# EAGLE design remote (EAGLE 7.6.0)
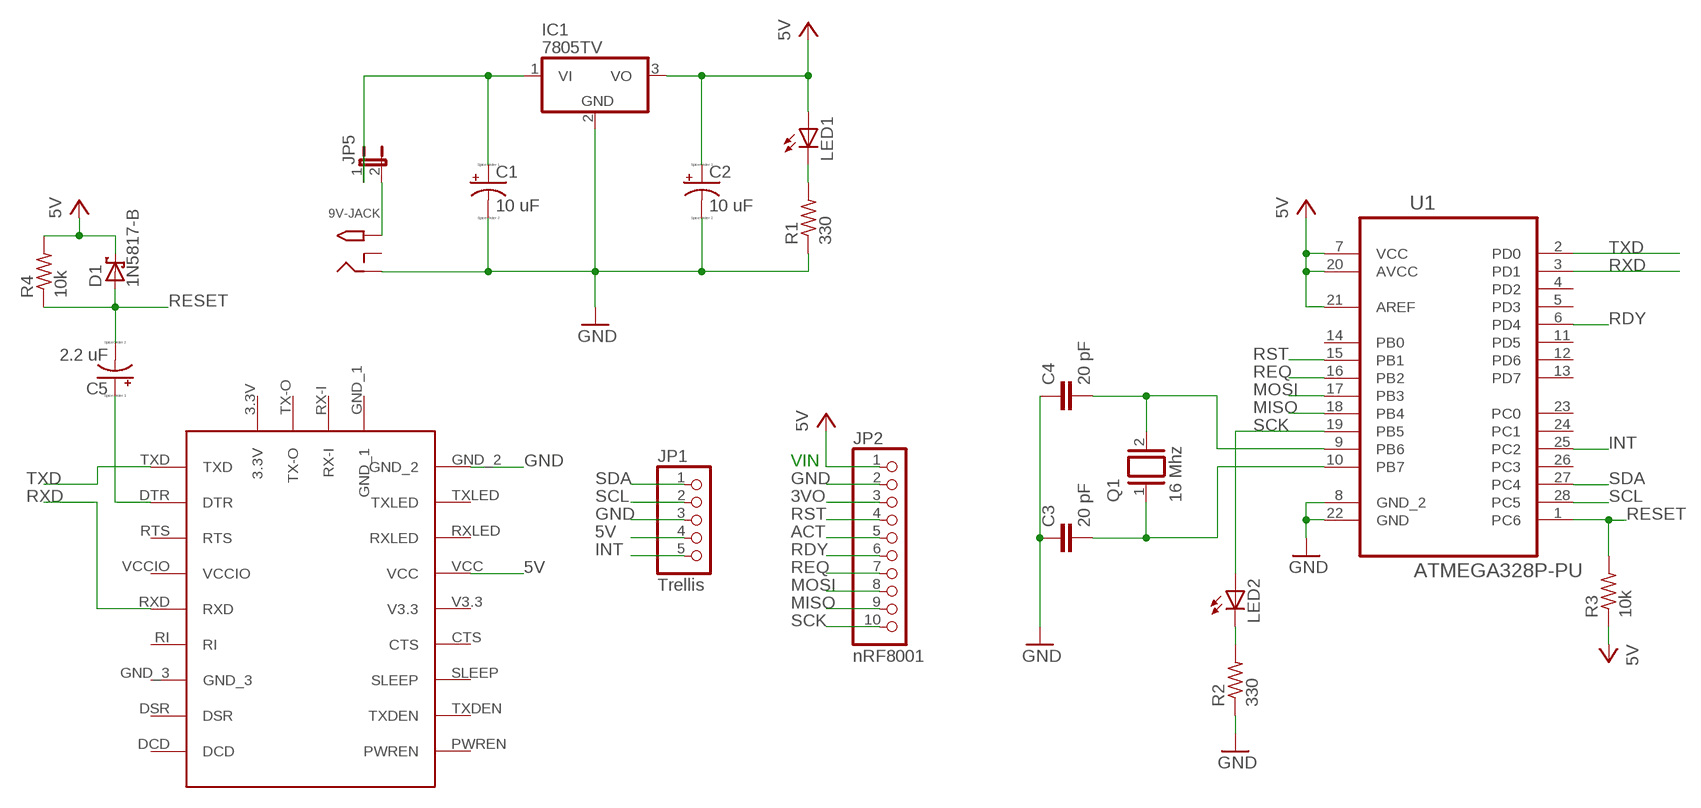
[diagram p0: schematic, sheet 1]

## Parts
9V-JACK  9V Input  2.1MMJACKTHM  [PJ-102A]
C1  10 uF  CPOL-USB45181B  [B45181B]
C2  10 uF  CPOL-USB45181B  [B45181B]
C3  20 pF  C-EU050-025X075  [C050-025X075]
C4  20 pF  C-EU050-025X075  [C050-025X075]
C5  2.2 uF  CPOL-USB45181B  [B45181B]
D1  1N5817-B  [DO41-7.6]
IC1  7805TV  [TO220V]
JP1  Trellis  PINHD-1X5  [1X05]
JP2  nRF8001  PINHD-1X10  [1X10]
JP5  JP1E  [JP1]
LED1  LED3MM  [LED3MM]
LED2  LED3MM  [LED3MM]
Q1  16 Mhz  XTAL/S  [QS]
R1  330  RESISTOR0309/10  [RES400MIL]
R2  330  RESISTOR0309/10  [RES400MIL]
R3  10k  RESISTOR0309/10  [RES400MIL]
R4  10k  RESISTOR0309/10  [RES400MIL]
U1  ATMEGA328P-PU  [DIP254P762X457-28]
U$1  FT232  [FT232]

## Nets
3VO: JP2.3
5V [power]: C2.+ D1.C IC1.3(VO) JP1.4 JP2.1 LED1.A R3.1 R4.2 U1.7(VCC) U1.20(AVCC) U1.21(AREF) U$1.VCC
ACT: JP2.5
GND [power]: 9V-JACK.RING C1.- C2.- C3.1 C4.1 IC1.2(GND) JP1.3 JP2.2 R1.1 R2.1 U1.8(GND_2) U1.22(GND) U$1.GND_2
INT: JP1.5 U1.25(PC2)
MISO: JP2.9 U1.18(PB4)
MOSI: JP2.8 U1.17(PB3)
N$1 [power]: C1.+ IC1.1(VI) JP5.1
N$2: LED1.K(C) R1.2
N$4: C3.2 Q1.1 U1.10(PB7)
N$5: C4.2 Q1.2 U1.9(PB6)
N$7: C5.+ U$1.DTR
N$8 [power]: 9V-JACK.TIP JP5.2
N$9: LED2.K(C) R2.2
RDY: JP2.6 U1.6(PD4)
REQ: JP2.7 U1.16(PB2)
RESET: C5.- D1.A R3.2 R4.1 U1.1(PC6)
RST: JP2.4 U1.15(PB1)
RXD: U1.3(PD1) U$1.RXD
SCK: JP2.10 LED2.A U1.19(PB5)
SCL: JP1.2 U1.28(PC5)
SDA: JP1.1 U1.27(PC4)
TXD: U1.2(PD0) U$1.TXD
Unconnected: 9V-JACK.RING_SW U1.4(PD2) U1.5(PD3) U1.11(PD5) U1.12(PD6) U1.13(PD7) U1.14(PB0) U1.23(PC0) U1.24(PC1) U1.26(PC3) U$1.3.3V U$1.CTS U$1.DCD U$1.DSR U$1.GND_1 U$1.GND_3 U$1.PWREN U$1.RI U$1.RTS U$1.RX-I U$1.RXLED U$1.SLEEP U$1.TX-O U$1.TXDEN U$1.TXLED U$1.V3.3 U$1.VCCIO

## Notes on the sheet
- VIN

## Library data of the parts
9V-JACK = adafruit:2.1MMJACK: 2.1mm x 5.5mm THM DC jack with internal switch. Digikey part #PJ-102A, 4UCON part #05537 2.1mm x 5.5mm SMT DC jack with internal switch. Digikey part #PJ-002A-SMT, 4UCON part #03267 By microbuilder.eu & adafruit.com
C1 C2 C5 = resistor:CPOL-US: POLARIZED CAPACITOR, American symbol
C3 C4 = resistor:C-EU: CAPACITOR, European symbol
D1 = diode:1N581*: 1.0A SCHOTTKY BARRIER RECTIFIER Source: http://www.diodes.com/datasheets/ds23001.pdf
IC1 = linear:78*: Positive VOLTAGE REGULATOR Source: http://cache.national.com/ds/LM/LM78L05.pdf http://www.fairchildsemi.com/ds/LM/LM7805.pdf
JP1 = pinhead:PINHD-1X5: PIN HEADER
JP2 = pinhead:PINHD-1X10: PIN HEADER
JP5 = jumper:JP1E: JUMPER
LED1 LED2 = EE445L:LED: Avago Technologies LED Green 2mA 5mm diffused, HLMP-4740, Digikey 516-1327-ND Red 1.6V 1mA 5mm diffused, HLMP-D150, Digikey 516-1323-ND Yellow 2mA 5mm diffused, HLMP-4719, Digikey 516-1326-ND Orange 10mA 5mm diffused HLMP-D401, Digikey 516-1330-ND Blue 10mA 5mm diffused
Q1 = special:XTAL/S: CRYSTAL
R1-R4 = EE445L:RESISTOR: RESISTOR, American symbol
U1 = Atmel_By_element14_Batch_1-00:ATMEGA328P-PU: 8-bit Microcontroller with In-System Programmable Flash; MPN: ATMEGA328P-PU; OC_FARNELL: 1715487; OC_NEWARK: 15R0268; PACKAGE: PDIP-28; SUPPLIER: Atmel
U$1 = ft232:FT232

## Net classes
0 default: width 0.406 mm, clearance 0.254 mm
1 power: width 0.711 mm, clearance 0.254 mm

## Board
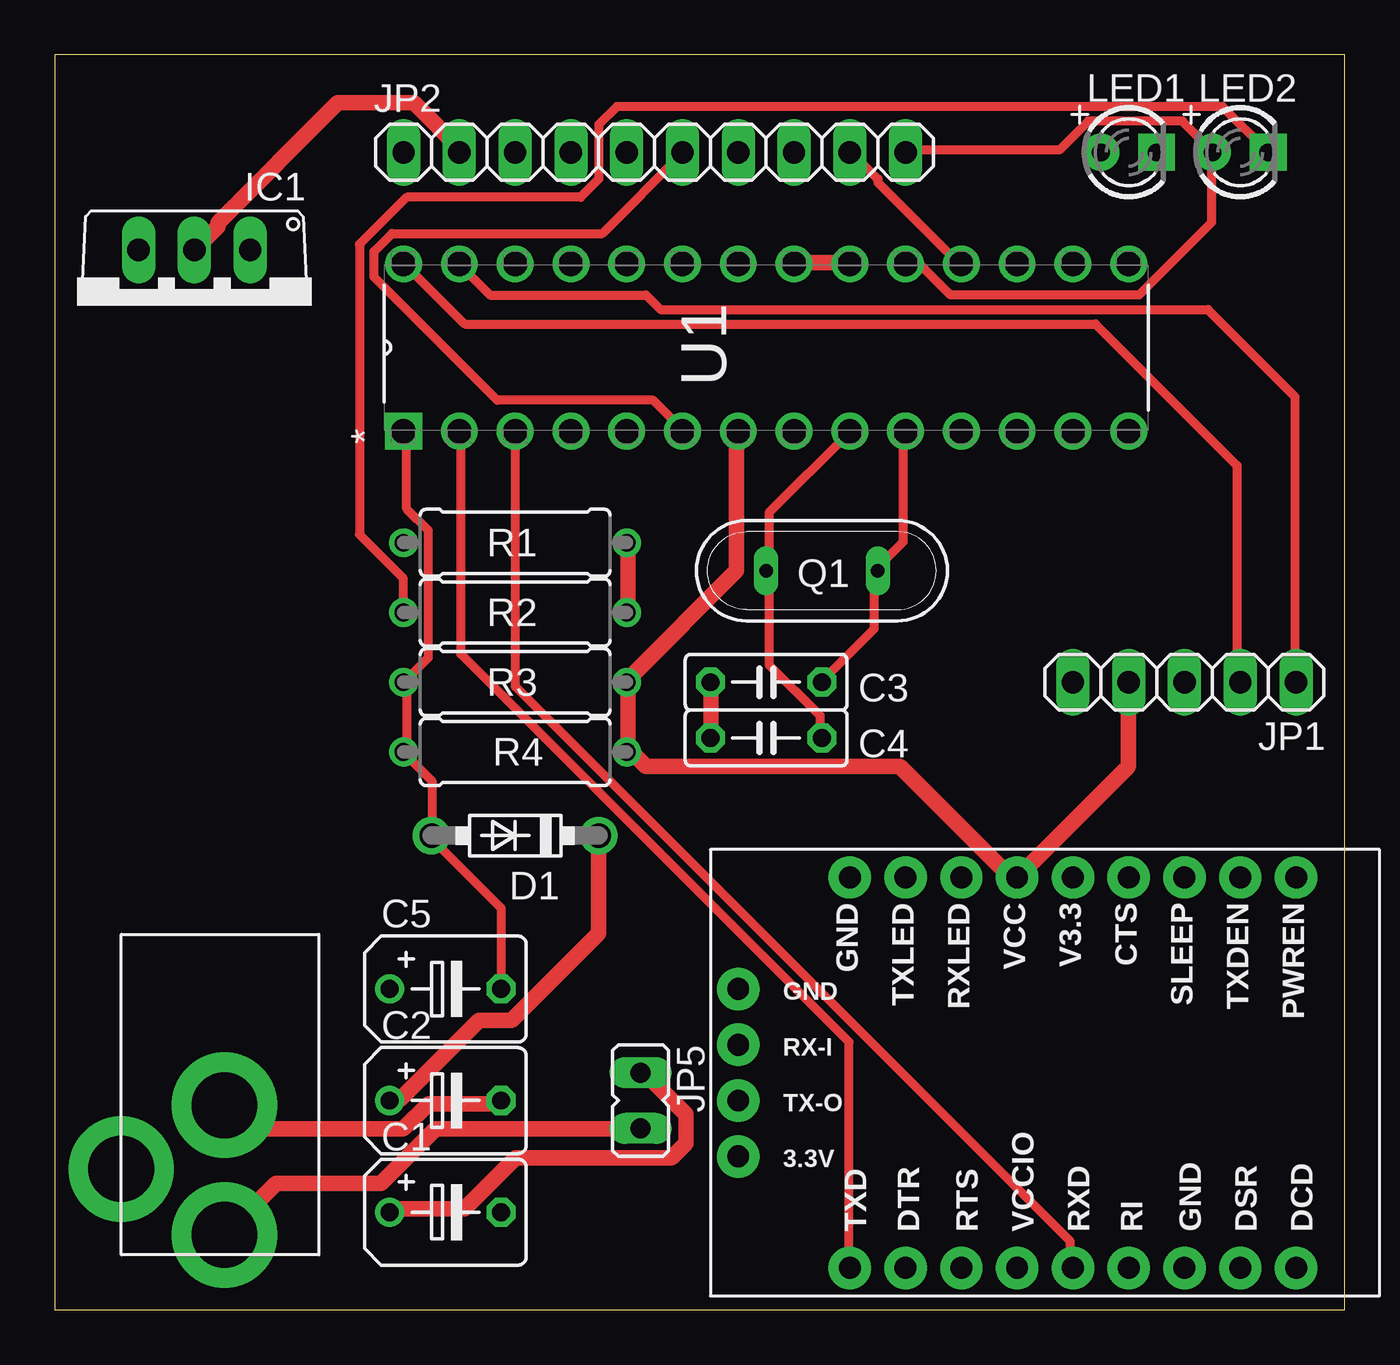
[diagram p1: board, top side]
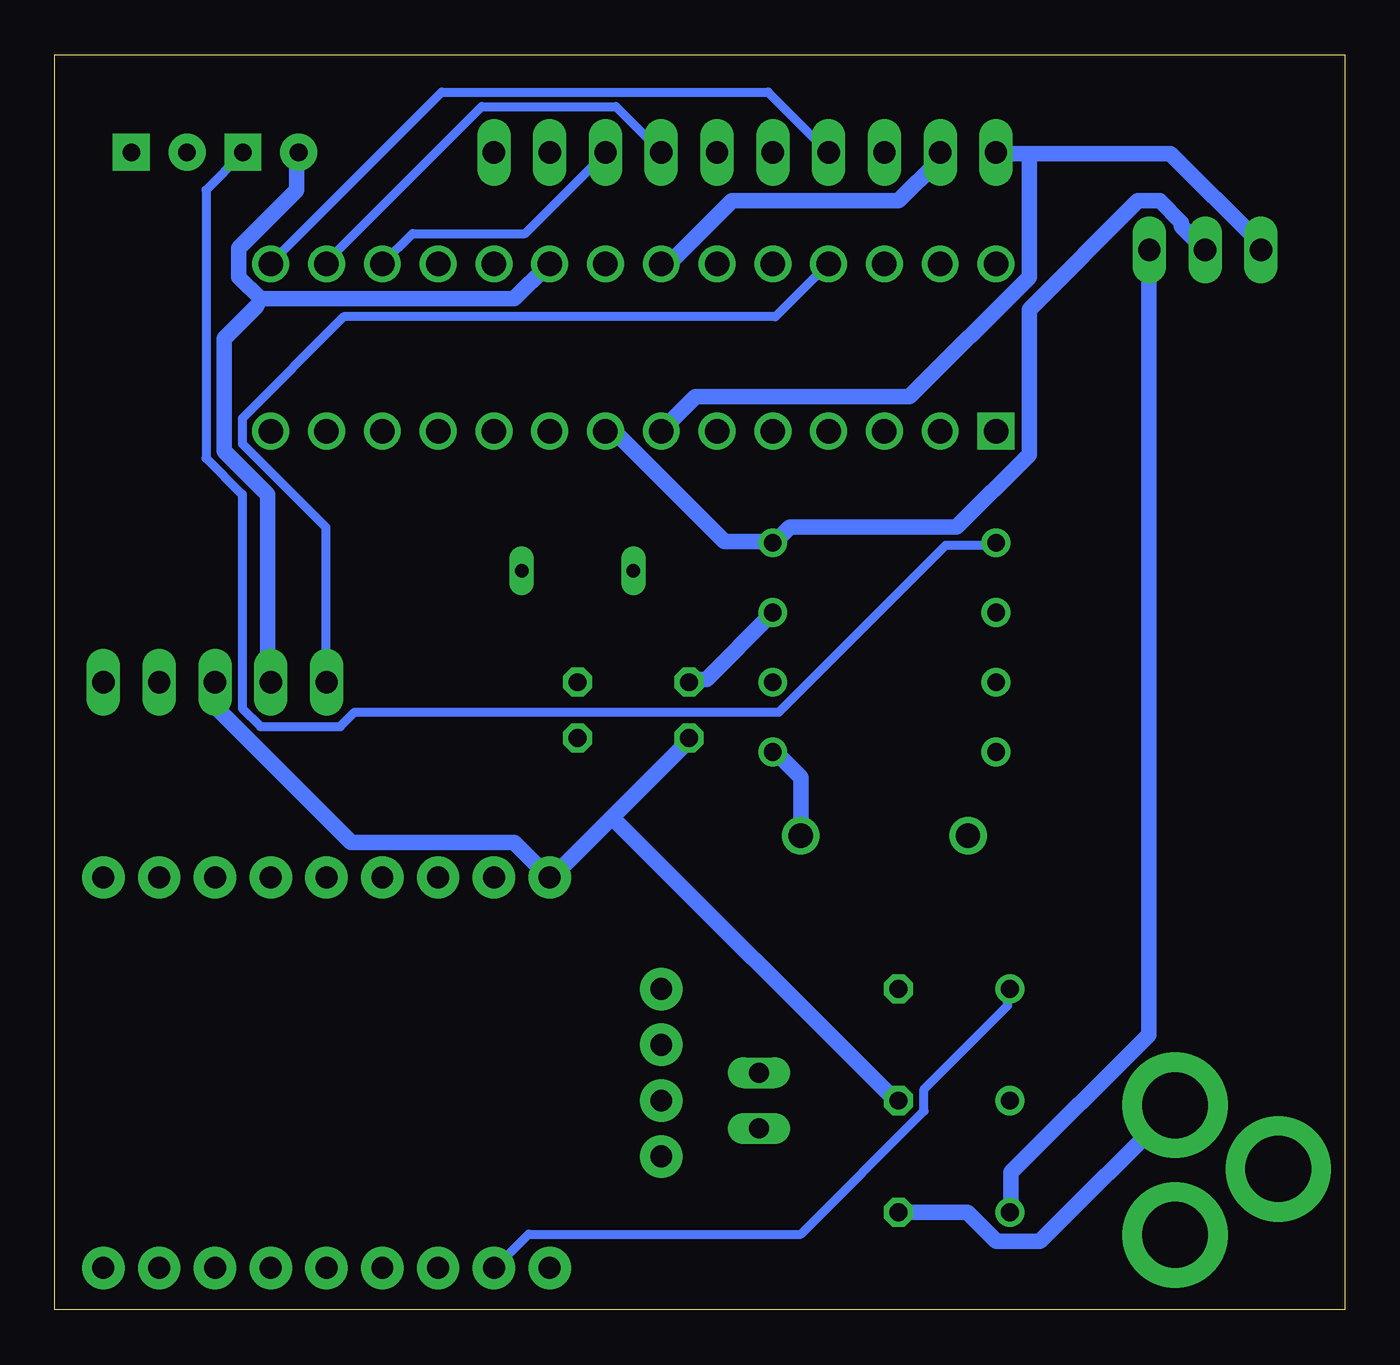
[diagram p2: board, bottom side, seen from below]

Size 58.73 x 57.14 mm. Coordinates in mm from the lower left corner, seen from the top.
Outline: 0,0 58.73,0 58.73,57.14 0,57.14 0,0
Copper layers (1*16): Top 0.035mm / dielectric 1.5mm / Bottom 0.035mm
Design rules "default": minimum track width 10mil, minimum drill 24mil, track to track 8mil, track to pad 8mil, pad to pad 8mil, via to via 8mil, smd to smd 8mil, copper to edge 40mil, drill to drill 8mil, minimum pad ring 10mil, minimum via ring 8mil, stop-mask expansion 4mil, vias tented up to drill 0mil, thermal gap 10mil

### Footprints (pad centres in the part's own frame; a part is rotated, then mirrored left to right if it is on the bottom)
PJ-102A = drill 3 pad 4.8: RING 0.1,-3.39; RING_SW -4.6,-6.29; TIP 0.1,-9.29
B45181B = drill 0.813: + -2.54,0 | drill 0.813 octagon: - 2.54,0
C050-025X075 = drill 0.813 octagon: 1 -2.54,0; 2 2.54,0
DO41-7.6 = drill 1.1 pad 1.7: A 3.81,0; C -3.81,0
TO220V = drill 1.016 long: 1 -2.54,-2.54; 2 0,-2.54; 3 2.54,-2.54
1X05 = drill 1.016 long: 1 -5.08,0; 2 -2.54,0; 3 0,0; 4 2.54,0; 5 5.08,0
1X10 = drill 1.016 long: 1 -11.43,0; 2 -8.89,0; 3 -6.35,0; 4 -3.81,0; 5 -1.27,0; 6 1.27,0; 7 3.81,0; 8 6.35,0; 9 8.89,0; 10 11.43,0
JP1 = drill 0.914 long: 1 0,-1.27; 2 0,1.27
LED3MM = drill 0.8 pad 1.676: A -1.27,0 | drill 0.8 pad 1.676 square: K 1.27,0
QS = drill 0.61 long: 1 -2.54,0; 2 2.54,0
RES400MIL = drill 0.8: 1 -5.08,0; 2 5.08,0
DIP254P762X457-28 = drill 1.118 square: 1 -7.62,33.02 | drill 1.118: 2 -7.62,30.48; 3 -7.62,27.94; 4 -7.62,25.4; 5 -7.62,22.86; 6 -7.62,20.32; 7 -7.62,17.78; 8 -7.62,15.24; 9 -7.62,12.7; 10 -7.62,10.16; 11 -7.62,7.62; 12 -7.62,5.08; 13 -7.62,2.54; 14 -7.62,0; 15 0,0; 16 0,2.54; 17 0,5.08; 18 0,7.62; 19 0,10.16; 20 0,12.7; 21 0,15.24; 22 0,17.78; 23 0,20.32; 24 0,22.86; 25 0,25.4; 26 0,27.94; 27 0,30.48; 28 0,33.02
FT232 = drill 1 pad 1.93: 3.3V -13.97,-5.08; CTS 3.81,7.62; DCD 11.43,-10.16; DSR 8.89,-10.16; DTR -6.35,-10.16; GND_1 -13.97,2.54; GND_2 -8.89,7.62; GND_3 6.35,-10.16; PWREN 11.43,7.62; RI 3.81,-10.16; RTS -3.81,-10.16; RX-I -13.97,0; RXD 1.27,-10.16; RXLED -3.81,7.62; SLEEP 6.35,7.62; TX-O -13.97,-2.54; TXD -8.89,-10.16; TXDEN 8.89,7.62; TXLED -6.35,7.62; V3.3 1.27,7.62; VCC -1.27,7.62; VCCIO -1.27,-10.16

### Placement (x,y rotation side)
9V-JACK  7.62,12.7 0 top
C1  17.78,4.44 0 top
C2  17.78,9.52 0 top
C3  32.38,28.57 0 top
C4  32.38,26.04 0 top
C5  17.78,14.61 0 top
D1  20.95,21.59 180 top
IC1  6.35,45.72 180 top
JP1  51.44,28.57 180 top
JP2  27.3,52.71 0 top
JP5  26.67,9.52 180 top
LED1  48.9,52.71 0 top
LED2  53.98,52.71 0 top
Q1  34.92,33.66 180 top
R1  20.95,34.93 180 top
R2  20.95,31.75 180 top
R3  20.95,28.57 180 top
R4  20.95,25.4 0 top
U1  48.9,47.62 90 top
U$1  45.09,12.06 0 top

### Tracks (layer width: path | path; a pad name or v marks a point on that pad's centre or on a via)
5V
  Top 0.711: JP1.4 48.87,28.54 48.87,24.74 U$1.VCC 43.59,19.95 43.26,19.95 38.47,24.74 26.91,24.74 26.42,25.23 R4.2 26.09,25.4 26.09,28.54 R3.1 26.25,28.87 31.04,33.66 31.04,39.93 U1.7 | U1.21 33.68,47.69 36.16,47.69 U1.20 | D1.C 24.77,17.14 20.8,13.18 19.32,13.18 15.68,9.55 15.35,9.55 C2.+
  Bottom 0.711: 49.37,46.04 50.35,47.03 50.35,48.35 47.71,50.99 47.71,52.64 LED1.A | 49.37,46.04 37.81,46.04 36.32,47.52 U1.20 | JP1.4 49.03,28.7 49.03,37.12 51.02,39.1 51.02,44.22 49.53,45.71 49.37,46.04 | 14.36,52.64 15.85,52.64 JP2.1 | 14.36,52.64 7.92,52.64 3.96,48.68 3.96,48.35 IC1.3 | 14.36,52.64 14.36,47.03 19.81,41.58 29.55,41.58 31.04,40.09 U1.7 | D1.C 24.77,24.24 25.92,25.4 R4.2
GND
  Top 0.711: IC1.2 7.43,49.34 7.43,49.51 12.88,54.95 16.34,54.95 18.49,52.81 JP2.2 | C2.- 20.31,9.38 17,9.38 15.85,8.23 8.75,8.23 7.76,9.22 9V-JACK.RING | C4.1 29.88,26.06 29.88,28.54 C3.1 | R2.1 26.09,31.84 26.09,34.81 R1.1
  Bottom 0.711: U1.22 31.04,47.69 30.71,47.69 27.9,50.5 20.31,50.5 18.49,52.31 18.49,52.64 JP2.2 | C1.- 20.31,4.43 17.17,4.43 15.85,3.11 13.87,3.11 7.76,9.22 9V-JACK.RING | U1.8 33.52,39.93 33.19,39.93 28.23,34.98 26.09,34.98 R1.1 25.76,35.14 25.26,35.64 17.67,35.64 14.36,38.94 14.36,45.54 9.41,50.5 8.42,50.5 7.43,49.51 7.43,49.34 IC1.2 | C3.1 29.72,28.7 29.06,28.7 26.09,31.67 R2.1 | JP1.3 51.35,28.54 51.35,27.38 45.24,21.27 37.81,21.27 36.32,19.79 U$1.GND_2 35.99,19.79 33.35,22.43 | 33.35,22.43 29.88,25.89 C4.1 | 33.35,22.43 20.47,9.55 C2.-
INT
  Bottom 0.406: JP1.5 46.39,28.7 46.39,35.64 50.19,39.43 50.19,40.59 45.57,45.21 25.92,45.21 23.61,47.52 U1.25
MISO
  Top 0.406: JP2.9 36.32,52.64 37.48,51.49 37.48,51.32 41.27,47.52 U1.18
MOSI
  Bottom 0.406: U1.17 42.43,49.01 37.31,49.01 33.68,52.64 JP2.8
N$1
  Top 0.711: C1.+ 15.35,4.6 18.66,4.6 20.97,6.91 28.07,6.91 28.73,7.57 28.73,8.89 26.75,10.87 JP5.1
  Bottom 0.711: IC1.1 8.91,48.18 8.91,12.52 15.19,6.25 15.19,4.6 C1.+
N$2
  Bottom 0.406: R1.2 16.02,34.81 18.16,34.81 25.76,27.22 45.07,27.22 45.73,26.56 49.37,26.56 50.19,27.38 50.19,37.12 51.84,38.77 51.84,50.99 50.19,52.64 LED1.K
N$4
  Top 0.406: C3.2 35,28.7 37.31,31.01 37.31,33.66 Q1.1 37.48,33.82 38.63,34.98 38.63,39.93 U1.10
N$5
  Top 0.406: U1.9 36.16,39.93 32.52,36.3 32.52,33.66 Q1.2 32.52,33.49 32.52,29.36 34.84,27.05 34.84,26.06 C4.2
N$7
  Bottom 0.406: C5.+ 15.35,14.5 15.35,13.84 19.15,10.05 19.15,9.05 24.77,3.44 37.15,3.44 38.63,1.96 U$1.DTR
N$8
  Top 0.711: JP5.2 26.58,8.23 17.34,8.23 14.86,5.75 10.07,5.75 7.76,3.44 9V-JACK.TIP
N$9
  Top 0.406: LED2.K 53.16,54.79 25.59,54.79 24.77,53.96 24.77,51.49 23.94,50.66 16.02,50.66 13.87,48.51 13.87,35.31 15.85,33.33 15.85,31.84 R2.2
RDY
  Top 0.406: JP2.6 28.56,52.64 24.93,49.01 15.35,49.01 14.53,48.18 14.53,47.03 20.14,41.41 27.24,41.41 28.56,40.09 U1.6
REQ
  Bottom 0.406: JP2.7 31.2,52.81 33.19,54.79 39.29,54.79 46.39,47.69 U1.16
RESET
  Top 0.406: C5.- 20.31,14.67 20.31,18.3 17.17,21.44 D1.A 17.17,21.77 17.17,24.08 16.02,25.23 R4.1 16.02,25.4 16.02,28.54 R3.2 16.02,28.7 17,29.69 17,35.47 16.02,36.46 16.02,39.93 U1.1
RST
  Bottom 0.406: JP2.4 23.61,52.81 26.25,55.45 41.11,55.45 48.87,47.69 U1.15
RXD
  Top 0.406: U1.3 20.97,39.93 20.97,28.37 46.23,3.11 46.23,1.96 U$1.RXD
SCK
  Top 0.406: JP2.10 38.8,52.81 45.73,52.81 47.05,54.13 51.35,54.13 52.67,52.81 LED2.A 52.67,52.64 52.67,49.51 49.37,46.2 40.78,46.2 39.46,47.52 38.8,47.52 U1.19
SCL
  Top 0.406: JP1.2 53.82,28.7 53.82,38.44 47.38,44.88 18.66,44.88 16.02,47.52 U1.28
SDA
  Top 0.406: JP1.1 56.46,28.7 56.46,41.58 52.5,45.54 27.57,45.54 26.91,46.2 19.81,46.2 18.49,47.52 U1.27
TXD
  Top 0.406: U1.2 18.49,39.93 18.49,29.86 36.16,12.19 36.16,1.96 U$1.TXD